# Altium schematic sheet Processor.SchDoc
size A3; Organization: Altium Limited; Address1: L3, 12a Rodborough Rd; Address2: Frenchs Forest; Address3: NSW; Address4: Australia 2086; DocumentNumber: 5; SheetNumber: 5; SheetTotal: 8
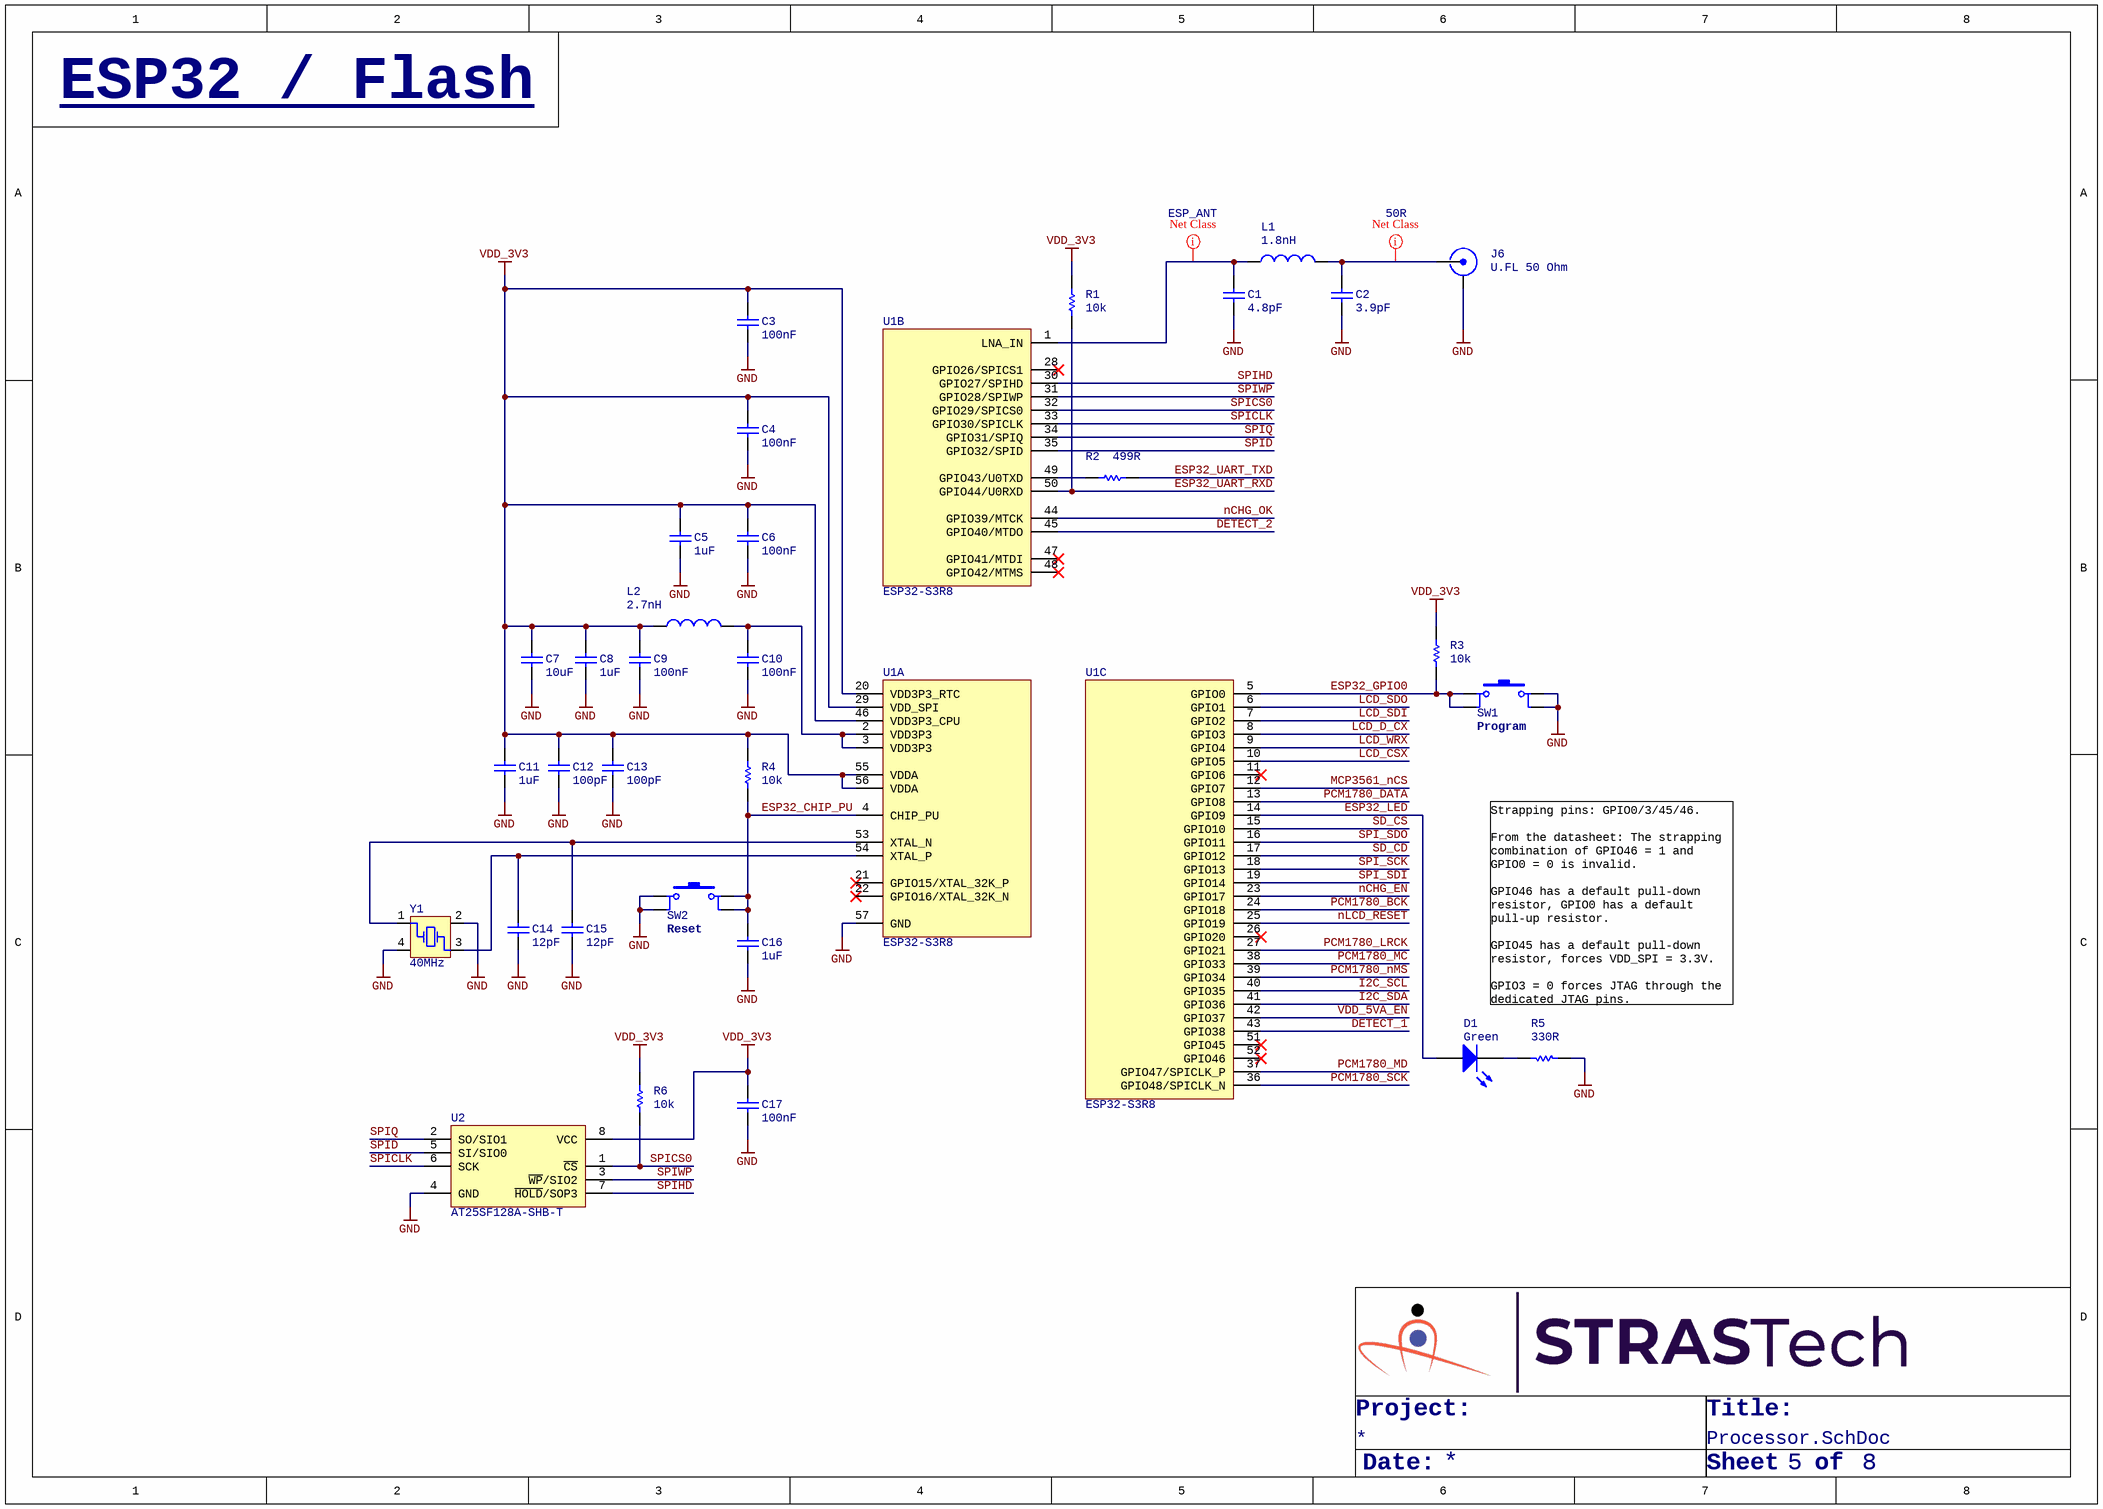
[diagram p0: Processor.SchDoc]

## Parts
C1  4.8pF  [Cap,SMD,0402]
C2  3.9pF  [Cap,SMD,0402]
C3  100nF  [Cap,SMD,0402]
C4  100nF  [Cap,SMD,0402]
C5  1uF  [Cap,SMD,0402]
C6  100nF  [Cap,SMD,0402]
C7  10uF  [Cap,SMD,0402]
C8  1uF  [Cap,SMD,0402]
C9  100nF  [Cap,SMD,0402]
C10  100nF  [Cap,SMD,0402]
C11  1uF  [Cap,SMD,0402]
C12  100pF  [Cap,SMD,0402]
C13  100pF  [Cap,SMD,0402]
C14  12pF  [Cap,SMD,0402]
C15  12pF  [Cap,SMD,0402]
C16  1uF  [Cap,SMD,0402]
C17  100nF  [Cap,SMD,0402]
D1  Green  [LED,0603]
J6  U.FL 50 Ohm  [CONN,UFL,50Ohm,SMD]
L1  1.8nH  [ind,0402]
L2  2.7nH  [ind,0402]
R1  10k  [RES,0402]
R2  499R  [RES,0402]
R3  10k  [RES,0402]
R4  10k  [RES,0402]
R5  330R  [RES,0402]
R6  10k  [RES,0402]
SW1  Switch  [Switch,Tactile,Micro,SPST-NO,SMD]  (value not drawn)
SW2  Switch  [Switch,Tactile,Micro,SPST-NO,SMD]  (value not drawn)
U1  ESP32-S3R8  [IC,QFN-56,7X7,P0.4MM]  (parts A,B,C of 3)
U2  AT25SF128A-SHB-T  [IC,SOIC-8,1.27mm,W5.28]
Y1  40MHz  [XTAL,SMD,4 Pin,2x2.5mm]

## Nets
GND: C1.1 C2.1 C3.1 C4.1 C5.1 C6.1 C7.1 C8.1 C9.1 C10.1 C11.1 C12.1 C13.1 C14.2 C15.2 C16.1 C17.1 J6.2 R5.1 SW1.3 SW1.4 SW2.1 SW2.2 U1.57(GND) U2.4(GND) Y1.2(GND) Y1.4(GND)
VDD_3V3: C3.2 C4.2 C5.2 C6.2 C7.2 C8.2 C9.2 C11.2 C12.2 C13.2 C17.2 L2.1 R1.2 R3.1 R4.1 R6.2 U1.20(VDD3P3_RTC) U1.29(VDD_SPI) U1.46(VDD3P3_CPU) U1.55(VDDA) U1.56(VDDA) U2.8(VCC)
DETECT_1: U1.43(GPIO38)
DETECT_2: U1.45(GPIO40/MTDO)
ESP32_CHIP_PU: C16.2 R4.2 SW2.3 SW2.4 U1.4(CHIP_PU)
ESP32_GPIO0: R3.2 SW1.1 SW1.2 U1.5(GPIO0)
ESP32_LED: D1.1(A) U1.14(GPIO9)
ESP32_UART_RXD: R1.1 U1.50(GPIO44/U0RXD)
ESP32_UART_TXD: R2.2
I2C_SCL: U1.40(GPIO35)
I2C_SDA: U1.41(GPIO36)
LCD_CSX: U1.10(GPIO5)
LCD_D_CX: U1.8(GPIO3)
LCD_SDI: U1.7(GPIO2)
LCD_SDO: U1.6(GPIO1)
LCD_WRX: U1.9(GPIO4)
MCP3561_nCS: U1.12(GPIO7)
nCHG_EN: U1.23(GPIO17)
nCHG_OK: U1.44(GPIO39/MTCK)
nLCD_RESET: U1.25(GPIO19)
PCM1780_BCK: U1.24(GPIO18)
PCM1780_DATA: U1.13(GPIO8)
PCM1780_LRCK: U1.27(GPIO21)
PCM1780_MC: U1.38(GPIO33)
PCM1780_MD: U1.37(GPIO47/SPICLK_P)
PCM1780_nMS: U1.39(GPIO34)
PCM1780_SCK: U1.36(GPIO48/SPICLK_N)
SD_CD: U1.17(GPIO12)
SD_CS: U1.15(GPIO10)
SPI_SCK: U1.18(GPIO13)
SPI_SDI: U1.19(GPIO14)
SPI_SDO: U1.16(GPIO11)
SPICLK: U1.33(GPIO30/SPICLK) U2.6(SCK)
SPICS0: R6.1 U1.32(GPIO29/SPICS0) U2.1(~{CS})
SPID: U1.35(GPIO32/SPID) U2.5(SI/SIO0)
SPIHD: U1.30(GPIO27/SPIHD) U2.7(~{HOLD}/SOP3)
SPIQ: U1.34(GPIO31/SPIQ) U2.2(SO/SIO1)
SPIWP: U1.31(GPIO28/SPIWP) U2.3(~{WP}/SIO2)
VDD_5VA_EN: U1.42(GPIO37)
NetC1_2: C1.2 L1.1 U1.1(LNA_IN)
NetC2_2: C2.2 J6.1 L1.2
NetC10_2: C10.2 L2.2 U1.2(VDD3P3) U1.3(VDD3P3)
NetC14_1: C14.1 U1.54(XTAL_P) Y1.3(OSC2)
NetC15_1: C15.1 U1.53(XTAL_N) Y1.1(OSC1)
NetD1_2: D1.2(K) R5.2
NetR2_1: R2.1 U1.49(GPIO43/U0TXD)

Not connected (* = marked no-connect by the designer): U1 11(GPIO6)* 21(GPIO15/XTAL_32K_P)* 22(GPIO16/XTAL_32K_N)* 26(GPIO20)* 28(GPIO26/SPICS1)* 47(GPIO41/MTDI)* 48(GPIO42/MTMS)* 51(GPIO45)* 52(GPIO46)*

## Layout directives
net class ESP_ANT: NetC1_2
net class 50R: NetC2_2

## Notes on the sheet
- ESP32 / Flash
- (near SW1) Program
- (near SW2) Reset
- Strapping pins: GPIO0/3/45/46.
  From the datasheet: The strapping combination of GPIO46 = 1 and GPIO0 = 0 is invalid.
  GPIO46 has a default pull-down resistor, GPIO0 has a default pull-up resistor.
  GPIO45 has a default pull-down resistor, forces VDD_SPI = 3.3V.
  GPIO3 = 0 forces JTAG through the dedicated JTAG pins.
- Project:
- Title:
- Date:
- Sheet
- of
- Title
- Size:
- A3
- Revision:
- Design By:

## Library data of the parts
C1 = CAP,Cer,4.8pF,50VDC,C0G/NP0,0402: 4.8 pF ±0.25pF 50V Ceramic Capacitor C0G, NP0 0402 (1005 Metric); Vendor Part Number: 490-17481-1-ND; Manufacturer: Murata Electronics; Manufacturer Part Number: GCQ1555C1H4R8CB01D; Vendor: Digikey; HelpURL: https://search.murata.co.jp/Ceramy/image/img/A01X/G101/ENG/GCQ1555C1H4R8CB01-01.pdf; CreatedBy: Judd Foster
C2 = CAP,Cer,3.9pF,50VDC,C0G/NP0,0402: 3.9 pF ±0.1pF 50V Ceramic Capacitor C0G, NP0 0402 (1005 Metric); Vendor Part Number: 399-CBR04C399B5GACCT-ND; Manufacturer: KEMET; Manufacturer Part Number: CBR04C399B5GAC; Vendor: Digikey; HelpURL: https://api.kemet.com/component-edge/download/datasheet/CBR04C399B5GAC.pdf; CreatedBy: Judd Foster
C3 C4 C6 C9 C10 C17 = CAP,Cer,100nF,25VDC,X7R,0402: 0.1µF ±10% 25V Ceramic Capacitor X7R 0402 (1005 Metric); Vendor Part Number: 490-14603-1-ND; Manufacturer: Murata Electronics; Manufacturer Part Number: GRM155R71E104KE14J; Vendor: Digikey; HelpURL: https://search.murata.co.jp/Ceramy/image/img/A01X/G101/ENG/GRM155R71E104KE14-01.pdf; CreatedBy: Judd Foster
C5 C8 C11 = CAP,Cer,1uF,35VDC,X5R,0402: 1 µF ±10% 35V Ceramic Capacitor X5R 0402 (1005 Metric); Vendor Part Number: 445-9073-1-ND; Manufacturer: TDK Corporation; Manufacturer Part Number: C1005X5R1V105K050BC; Vendor: Digikey; HelpURL: https://product.tdk.com/info/en/catalog/datasheets/mlcc_commercial_general_en.pdf?ref_disty=digikey; CreatedBy: Judd Foster
C7 = CAP,Cer,10uF,10VDC,X5R,0402: 10 µF ±20% 10V Ceramic Capacitor X5R 0402 (1005 Metric); Vendor Part Number: 1276-1450-1-ND; Manufacturer: Samsung Electro-Mechanics; Manufacturer Part Number: CL05A106MP5NUNC; Vendor: Digikey; HelpURL: https://media.digikey.com/pdf/Data%20Sheets/Samsung%20PDFs/CL05A106MP5NUNC_Spec.pdf; CreatedBy: Judd Foster
C12 C13 = CAP,Cer,100pF,50VDC,C0G/NP0,0402: 100pF ±5% 50V Ceramic Capacitor C0G, NP0 0402 (1005 Metric); Vendor Part Number: 490-10669-1-ND; Manufacturer: Murata Electronics; Manufacturer Part Number: GCM1555C1H101JA16D; Vendor: Digikey; HelpURL: https://www.murata.com/~/media/webrenewal/support/library/catalog/products/capacitor/mlcc/c03e.ashx?la=en-us; CreatedBy: Judd Foster
C14 C15 = CAP,Cer,12pF,50VDC,C0G/NP0,0402: 12pF ±5% 50V Ceramic Capacitor C0G, NP0 0402 (1005 Metric); Vendor Part Number: 311-1016-1-ND; Manufacturer: Yageo; Manufacturer Part Number: CC0402JRNPO9BN120; Vendor: Digikey; HelpURL: https://www.yageo.com/upload/media/product/productsearch/datasheet/mlcc/UPY-GP_NP0_16V-to-50V_18.pdf; CreatedBy: Judd Foster
C16 = CAP,Cer,1uF,6.3VDC,X5R,0402: 1µF ±20% 6.3V Ceramic Capacitor X5R 0402 (1005 Metric); Vendor Part Number: 1276-1235-1-ND; Manufacturer: Samsung Electro-Mechanics; Manufacturer Part Number: CL05A105MQ5NNNC; Vendor: Digikey; HelpURL: https://media.digikey.com/pdf/Data%20Sheets/Samsung%20PDFs/CL_Series_MLCC_ds.pdf; CreatedBy: Judd Foster
D1 = LED,Green,SMD,0603: Green 530nm LED Indication - Discrete 3V 0603 (1608 Metric); Manufacturer: Stanley Electric Co; Manufacturer Part Number: THG1111C-0005-TR; Vendor Part Number: 404-1286-1-ND; Vendor: Digikey; CreatedBy: Judd Foster; HelpURL: http://www.stanley-components.com/php/downloaddatafile.php?rp=0,THG1111C-0005_e.pdf
J6 = Conn,RF,U.FL,50 Ohm,SMD: U.FL (UMCC) Connector Receptacle, Male Pin 50Ohm Surface Mount Solder; Manufacturer: Hirose Electric Co Ltd; Manufacturer Part Number: U.FL-R-SMT-1(40); Vendor Part Number: H125761CT-ND; Vendor: Digikey; CreatedBy: Judd Foster; HelpURL: https://www.hirose.com/product/document?clcode=CL0311-0300-2-40&productname=HRMP-U.FLJ(40)&series=U.FL&documenttype=Catalog&lang=en&documentid=D31697_en
L1 = IND,1.8nH,900mA,Multilayer,0402: 1.8 nH Unshielded Multilayer Inductor 900 mA 100mOhm Max 0402 (1005 Metric); Vendor Part Number: 490-1076-1-ND; Manufacturer: Murata Electronics; Manufacturer Part Number: LQG15HN1N8S02D; Vendor: Digikey; HelpURL: https://search.murata.co.jp/Ceramy/image/img/P02/JELF243B-0009.pdf; CreatedBy: Judd Foster
L2 = IND,2.7nH,800mA,Multilayer,0402: 2.7nH Unshielded Multilayer Inductor 800mA 150mOhm Max 0402 (1005 Metric); Vendor Part Number: 490-2615-1-ND; Manufacturer: Murata Electronics; Manufacturer Part Number: LQG15HS2N7S02D; Vendor: Digikey; HelpURL: https://psearch.en.murata.com/inductor/product/LQG15HS2N7S02_.pdf; CreatedBy: Judd Foster
R1 R3 R4 R6 = RES,10k,5%,0.063W,0402: 10 kOhms ±5% 0.063W, 1/16W Chip Resistor 0402 (1005 Metric) Automotive AEC-Q200 Thick Film; Vendor Part Number: RMCF0402JT10K0CT-ND; Manufacturer: Stackpole Electronics Inc; Manufacturer Part Number: RMCF0402JT10K0; Vendor: DIgikey; HelpURL: https://www.seielect.com/catalog/sei-rmcf_rmcp.pdf; CreatedBy: Judd Foster
R2 = RES,499R,1%,0.063W,0402: 499 Ohms ±1% 0.063W, 1/16W Chip Resistor 0402 (1005 Metric) Automotive AEC-Q200 Thick Film; Manufacturer: Stackpole Electronics Inc; Manufacturer Part Number: RMCF0402FT499R; Vendor Part Number: RMCF0402FT499RCT-ND; Vendor: Digikey; CreatedBy: Judd Foster; HelpURL: https://www.seielect.com/catalog/sei-rmcf_rmcp.pdf
R5 = RES,330R,5%,0.063W,0402: 330 Ohms ±5% 0.063W, 1/16W Chip Resistor 0402 (1005 Metric) Automotive AEC-Q200 Thick Film; Manufacturer: Stackpole Electronics Inc; Manufacturer Part Number: RMCF0402JT330R; Vendor Part Number: RMCF0402JT330RCT-ND; Vendor: Digikey; CreatedBy: Judd Foster; HelpURL: https://www.seielect.com/catalog/sei-rmcf_rmcp.pdf
SW1 SW2 = Switch,Tactile,SPST-NO,SMD,H1.5: Tactile Switch SPST-NO Top Actuated Surface Mount; Manufacturer: C&K; Manufacturer Part Number: PTS525SM15SMTR2 LFS; Vendor Part Number: CKN9104CT-ND; Vendor: Digikey; CreatedBy: Judd Foster; HelpURL: https://www.ckswitches.com/media/1467/pts525.pdf
U1 = ESP32-S3R8: IC RF TxRx + MCU Bluetooth, WiFi 802.11b/g/n, Bluetooth v5.0 2.412GHz ~ 2.484GHz 56-VFQFN Exposed Pad; Manufacturer: Espressif Systems; Vendor Part Number: 1904-ESP32-S3R8-ND; Vendor: Digikey; CreatedBy: Judd Foster; HelpURL: https://www.espressif.com/sites/default/files/documentation/esp32-s3_datasheet_en.pdf; Manufacturer Part Number: ESP32-S3R8
U2 = AT25SF128A-SHB-T: FLASH - NOR Memory IC 128Mb (16M x 8) SPI - Quad I/O 133 MHz 8-SOIC; Manufacturer: Adesto Technologies; Vendor Part Number: 1265-1348-1-ND; Vendor: Digikey; CreatedBy: Judd Foster; HelpURL: https://www.dialog-semiconductor.com/sites/default/files/2021-02/DS-AT25SF128A-168.pdf; Manufacturer Part Number: AT25SF128A-SHB-T
Y1 = XTAL,40MHz,12pF,SMD: 40 MHz ±7ppm Crystal 12pF 25 Ohms 4-SMD, No Lead; Manufacturer: Hosonic Electronic Co., Ltd; Manufacturer Part Number: E2SB40E000104E; Vendor Part Number: 3186-E2SB40E000104ECT-ND; Vendor: Digikey; CreatedBy: Judd Foster; HelpURL: https://ecsxtal.com/store/pdf/ECS-33B.pdf